# Altium schematic sheet martix_connect.SchDoc
size A4 portrait
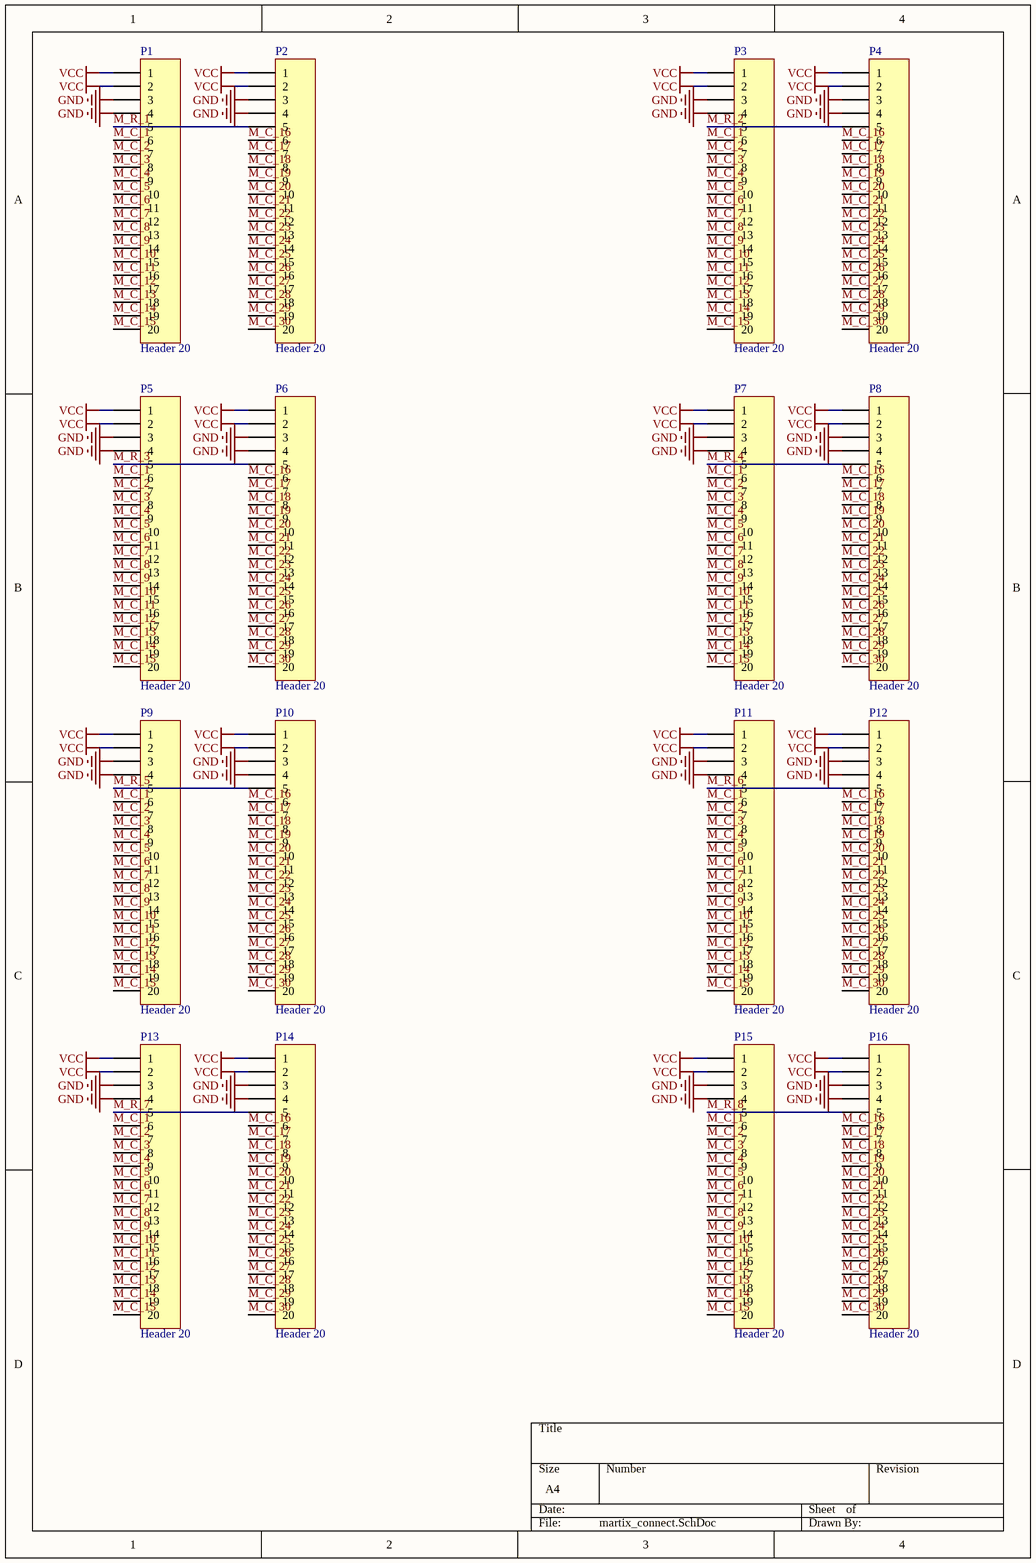
[diagram p0: martix_connect.SchDoc]

## Parts
P1  Header 20  [FPC0.5 2H-WS-20P]
P2  Header 20  [FPC0.5 2H-WS-20P]
P3  Header 20  [FPC0.5 2H-WS-20P]
P4  Header 20  [FPC0.5 2H-WS-20P]
P5  Header 20  [FPC0.5 2H-WS-20P]
P6  Header 20  [FPC0.5 2H-WS-20P]
P7  Header 20  [FPC0.5 2H-WS-20P]
P8  Header 20  [FPC0.5 2H-WS-20P]
P9  Header 20  [FPC0.5 2H-WS-20P]
P10  Header 20  [FPC0.5 2H-WS-20P]
P11  Header 20  [FPC0.5 2H-WS-20P]
P12  Header 20  [FPC0.5 2H-WS-20P]
P13  Header 20  [FPC0.5 2H-WS-20P]
P14  Header 20  [FPC0.5 2H-WS-20P]
P15  Header 20  [FPC0.5 2H-WS-20P]
P16  Header 20  [FPC0.5 2H-WS-20P]

## Nets
GND: P1.3 P1.4 P2.3 P2.4 P3.3 P3.4 P4.3 P4.4 P5.3 P5.4 P6.3 P6.4 P7.3 P7.4 P8.3 P8.4 P9.3 P9.4 P10.3 P10.4 P11.3 P11.4 P12.3 P12.4 P13.3 P13.4 P14.3 P14.4 P15.3 P15.4 P16.3 P16.4
VCC: P1.1 P1.2 P2.1 P2.2 P3.1 P3.2 P4.1 P4.2 P5.1 P5.2 P6.1 P6.2 P7.1 P7.2 P8.1 P8.2 P9.1 P9.2 P10.1 P10.2 P11.1 P11.2 P12.1 P12.2 P13.1 P13.2 P14.1 P14.2 P15.1 P15.2 P16.1 P16.2
M_C_1: P1.6 P3.6 P5.6 P7.6 P9.6 P11.6 P13.6 P15.6
M_C_2: P1.7 P3.7 P5.7 P7.7 P9.7 P11.7 P13.7 P15.7
M_C_3: P1.8 P3.8 P5.8 P7.8 P9.8 P11.8 P13.8 P15.8
M_C_4: P1.9 P3.9 P5.9 P7.9 P9.9 P11.9 P13.9 P15.9
M_C_5: P1.10 P3.10 P5.10 P7.10 P9.10 P11.10 P13.10 P15.10
M_C_6: P1.11 P3.11 P5.11 P7.11 P9.11 P11.11 P13.11 P15.11
M_C_7: P1.12 P3.12 P5.12 P7.12 P9.12 P11.12 P13.12 P15.12
M_C_8: P1.13 P3.13 P5.13 P7.13 P9.13 P11.13 P13.13 P15.13
M_C_9: P1.14 P3.14 P5.14 P7.14 P9.14 P11.14 P13.14 P15.14
M_C_10: P1.15 P3.15 P5.15 P7.15 P9.15 P11.15 P13.15 P15.15
M_C_11: P1.16 P3.16 P5.16 P7.16 P9.16 P11.16 P13.16 P15.16
M_C_12: P1.17 P3.17 P5.17 P7.17 P9.17 P11.17 P13.17 P15.17
M_C_13: P1.18 P3.18 P5.18 P7.18 P9.18 P11.18 P13.18 P15.18
M_C_14: P1.19 P3.19 P5.19 P7.19 P9.19 P11.19 P13.19 P15.19
M_C_15: P1.20 P3.20 P5.20 P7.20 P9.20 P11.20 P13.20 P15.20
M_C_16: P2.6 P4.6 P6.6 P8.6 P10.6 P12.6 P14.6 P16.6
M_C_17: P2.7 P4.7 P6.7 P8.7 P10.7 P12.7 P14.7 P16.7
M_C_18: P2.8 P4.8 P6.8 P8.8 P10.8 P12.8 P14.8 P16.8
M_C_19: P2.9 P4.9 P6.9 P8.9 P10.9 P12.9 P14.9 P16.9
M_C_20: P2.10 P4.10 P6.10 P8.10 P10.10 P12.10 P14.10 P16.10
M_C_21: P2.11 P4.11 P6.11 P8.11 P10.11 P12.11 P14.11 P16.11
M_C_22: P2.12 P4.12 P6.12 P8.12 P10.12 P12.12 P14.12 P16.12
M_C_23: P2.13 P4.13 P6.13 P8.13 P10.13 P12.13 P14.13 P16.13
M_C_24: P2.14 P4.14 P6.14 P8.14 P10.14 P12.14 P14.14 P16.14
M_C_25: P2.15 P4.15 P6.15 P8.15 P10.15 P12.15 P14.15 P16.15
M_C_26: P2.16 P4.16 P6.16 P8.16 P10.16 P12.16 P14.16 P16.16
M_C_27: P2.17 P4.17 P6.17 P8.17 P10.17 P12.17 P14.17 P16.17
M_C_28: P2.18 P4.18 P6.18 P8.18 P10.18 P12.18 P14.18 P16.18
M_C_29: P2.19 P4.19 P6.19 P8.19 P10.19 P12.19 P14.19 P16.19
M_C_30: P2.20 P4.20 P6.20 P8.20 P10.20 P12.20 P14.20 P16.20
M_R_1: P1.5 P2.5
M_R_2: P3.5 P4.5
M_R_3: P5.5 P6.5
M_R_4: P7.5 P8.5
M_R_5: P9.5 P10.5
M_R_6: P11.5 P12.5
M_R_7: P13.5 P14.5
M_R_8: P15.5 P16.5

## Library data of the parts
P1-P16 = Header 20: Header, 20-Pin; LatestRevisionDate: 17-Jul-2002; LatestRevisionNote: Re-released for DXP Platform.; Publisher: Altium Limited